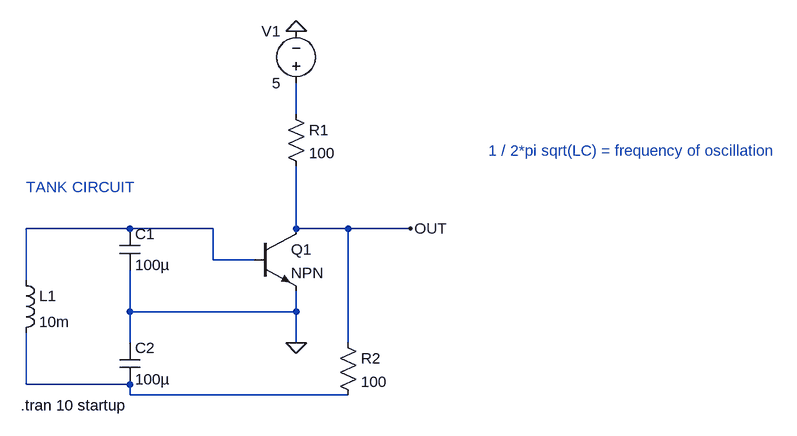
[diagram p0: schematic Colpitts Oscillator.asc]
Colpitts Oscillator.asc, the LTspice schematic file:
Version 4
SHEET 1 988 680
WIRE 192 176 192 128
WIRE -64 352 -224 352
WIRE 64 352 -64 352
WIRE 192 352 192 256
WIRE 272 352 192 352
WIRE 368 352 272 352
WIRE 64 400 64 352
WIRE 128 400 64 400
WIRE -224 432 -224 352
WIRE -64 480 -64 416
WIRE 192 480 192 448
WIRE 192 480 -64 480
WIRE -64 528 -64 480
WIRE 192 528 192 480
WIRE 272 528 272 352
WIRE -224 592 -224 512
WIRE -64 592 -224 592
WIRE -64 608 -64 592
WIRE 272 608 -64 608
FLAG 192 48 0
FLAG 192 528 0
FLAG 368 352 OUT
SYMBOL voltage 192 144 R180
WINDOW 0 24 96 Left 2
WINDOW 3 24 16 Left 2
WINDOW 123 0 0 Left 0
WINDOW 39 0 0 Left 0
SYMATTR InstName V1
SYMATTR Value 5
SYMBOL res 176 160 R0
SYMATTR InstName R1
SYMATTR Value 100
SYMBOL npn 128 352 R0
SYMATTR InstName Q1
SYMBOL cap -80 352 R0
SYMATTR InstName C1
SYMATTR Value 100µ
SYMBOL cap -80 528 R0
SYMATTR InstName C2
SYMATTR Value 100µ
SYMBOL res 256 512 R0
SYMATTR InstName R2
SYMATTR Value 100
SYMBOL ind -240 416 R0
SYMATTR InstName L1
SYMATTR Value 10m
TEXT -224 288 Left 2 ;TANK CIRCUIT
TEXT -232 624 Left 2 !.tran 10 startup
TEXT 488 232 Left 2 ;1 / 2*pi sqrt(LC) = frequency of oscillation

The netlist it stands for:
* Colpitts Oscillator.asc
V1 N001 0 5
R1 N001 OUT 100
Q1 OUT N002 0 0 NPN
C1 N002 0 100µ
C2 0 N003 100µ
R2 OUT N003 100
L1 N002 N003 10m
.model NPN NPN
.model PNP PNP
.lib standard.bjt
* TANK CIRCUIT
.tran 10 startup
* 1 / 2*pi sqrt(LC) = frequency of oscillation
.backanno
.end